# EAGLE board Servosolenoidvalve_of_Tatebayashi (EAGLE 9.4.2), part 1 of 2
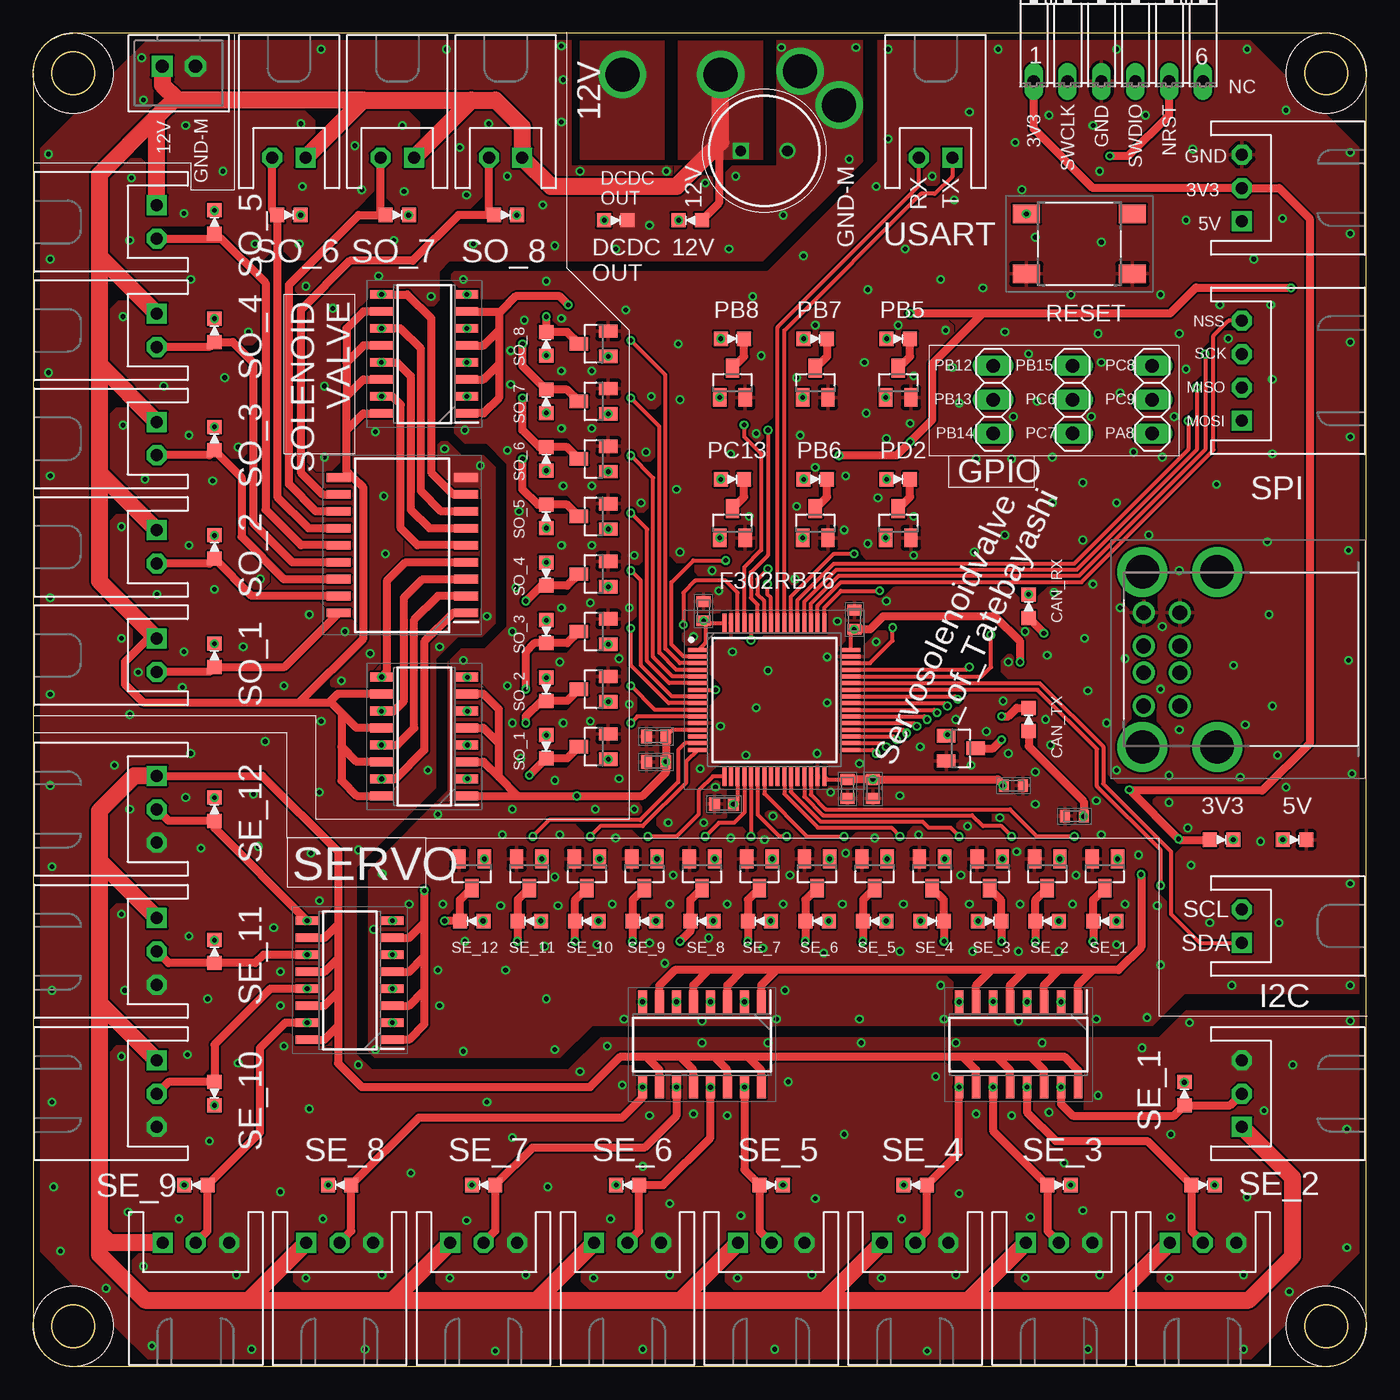
[diagram p3: board, top side]
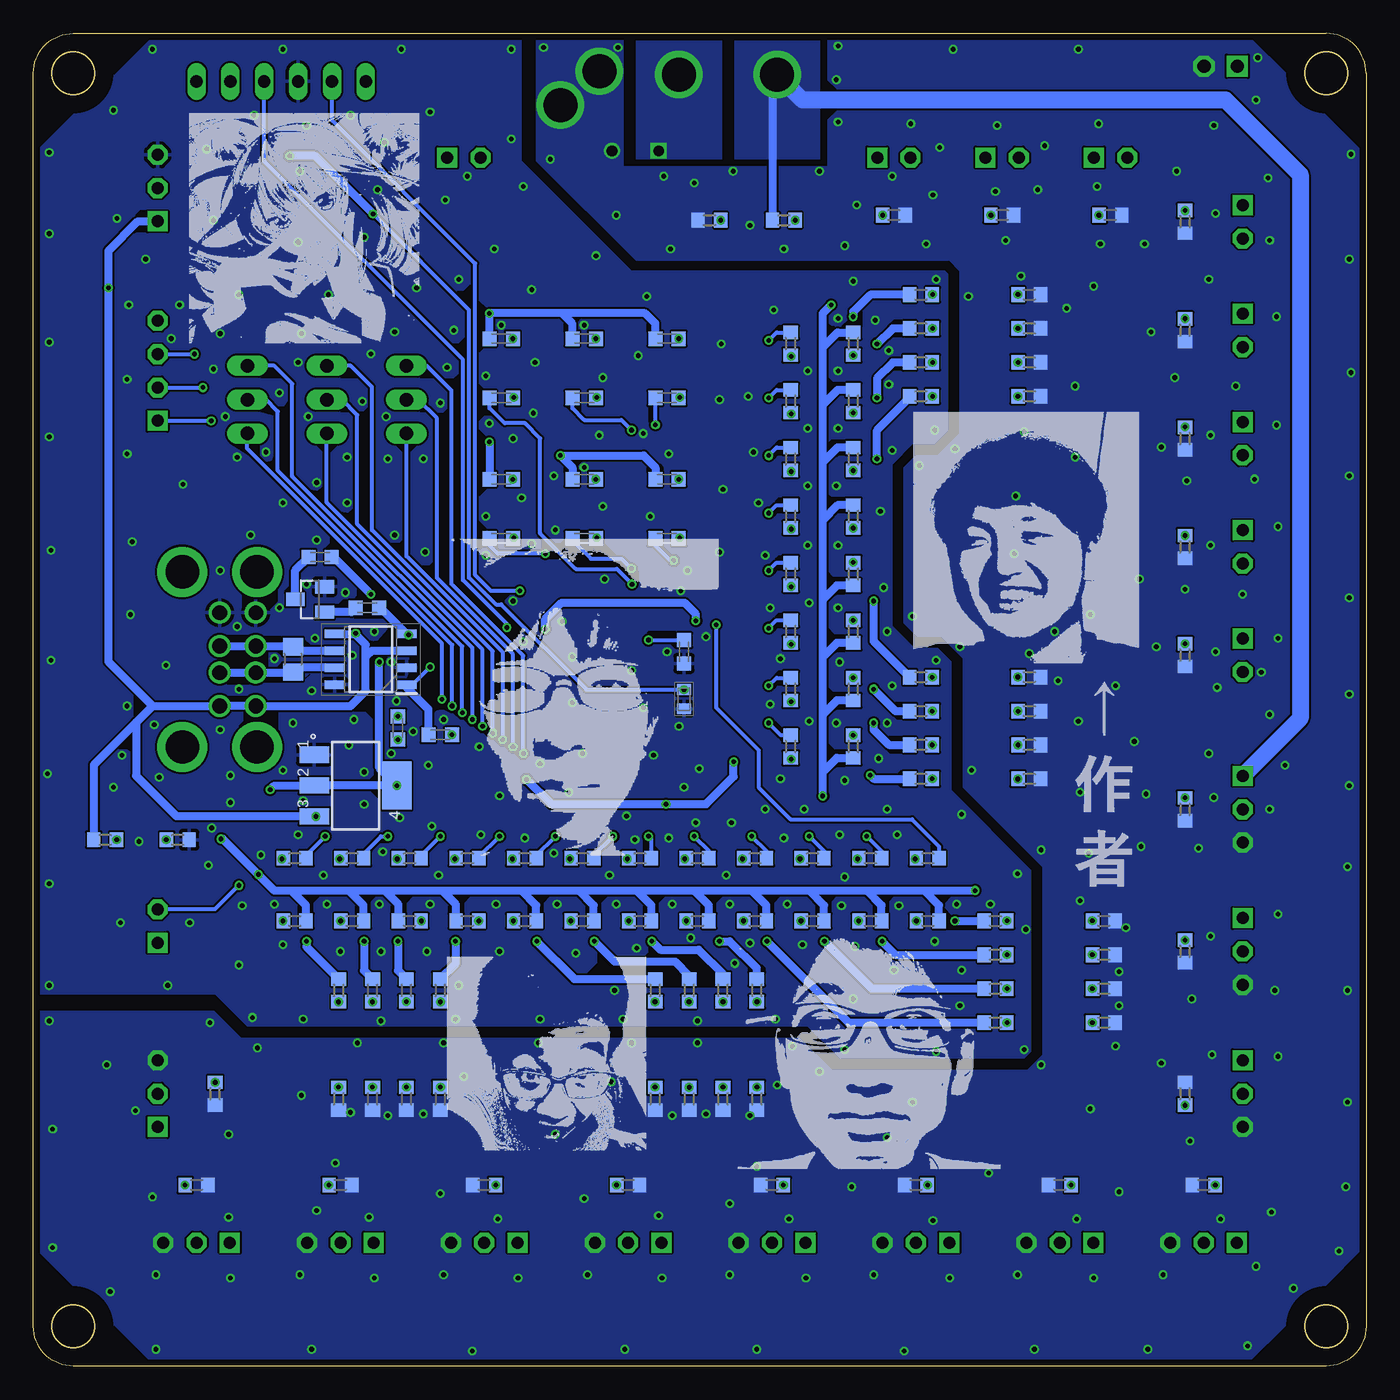
[diagram p4: board, bottom side, seen from below]

Size 100 x 100 mm. Coordinates in mm from the lower left corner, seen from the top.
Outline: 3,0 97,0 arc90 100,3 100,97 arc90 97,100 3,100 arc90 0,97 0,3 arc90 3,0
Outline: circle at 3,3 radius 1.6
Outline: circle at 3,97 radius 1.6
Outline: circle at 97,97 radius 1.6
Outline: circle at 97,3 radius 1.6
Copper layers (1*16): Top 0.035mm / dielectric 1.6mm / Bottom 0.035mm
Design rules "Elecrow_2-layer_PCB_eagle_rule": minimum track width 6mil, minimum drill 12mil, track to track 6mil, track to pad 6mil, pad to pad 6mil, via to via 8mil, smd to smd 0mil, copper to edge 20mil, drill to drill 10mil, minimum pad ring 6mil, minimum via ring 6mil, stop-mask expansion 0mil, vias tented up to drill 100mil, thermal gap 10mil
tRestrict: area 94,0 to 100,6; area 94,94 to 100,100; area 0,0 to 6,6; area 0,94 to 6,100; 335 lines
bRestrict: area 94,94 to 100,100; area 0,94 to 6,100; area 94,0 to 100,6; area 0,0 to 6,6; 283 lines

## Footprints (pad centres in the part's own frame; a part is rotated, then mirrored left to right if it is on the bottom)
CAPC1709X100N = smd 0.81 x 1.04: 1 -0.72,0; 2 0.72,0
CAPC1608X90N = smd 0.75 x 0.94: 1 -0.7,0; 2 0.7,0
CAPPRD350W60D825H1150 = drill 0.8 pad 1.2 square: 1 0,0 | drill 0.8 pad 1.2: 2 3.5,0
QFP50P1200X1200X160-64N = smd 1.475 x 0.3: 1 -5.738,3.75; 2 -5.738,3.25; 3 -5.738,2.75; 4 -5.738,2.25; 5 -5.738,1.75; 6 -5.738,1.25; 7 -5.738,0.75; 8 -5.738,0.25; 9 -5.738,-0.25; 10 -5.738,-0.75; 11 -5.738,-1.25; 12 -5.738,-1.75; 13 -5.738,-2.25; 14 -5.738,-2.75; 15 -5.738,-3.25; 16 -5.738,-3.75; 33 5.738,-3.75; 34 5.738,-3.25; 35 5.738,-2.75; 36 5.738,-2.25; 37 5.738,-1.75; 38 5.738,-1.25; 39 5.738,-0.75; 40 5.738,-0.25; 41 5.738,0.25; 42 5.738,0.75; 43 5.738,1.25; 44 5.738,1.75; 45 5.738,2.25; 46 5.738,2.75; 47 5.738,3.25; 48 5.738,3.75 | smd 0.3 x 1.475: 17 -3.75,-5.738; 18 -3.25,-5.738; 19 -2.75,-5.738; 20 -2.25,-5.738; 21 -1.75,-5.738; 22 -1.25,-5.738; 23 -0.75,-5.738; 24 -0.25,-5.738; 25 0.25,-5.738; 26 0.75,-5.738; 27 1.25,-5.738; 28 1.75,-5.738; 29 2.25,-5.738; 30 2.75,-5.738; 31 3.25,-5.738; 32 3.75,-5.738; 49 3.75,5.738; 50 3.25,5.738; 51 2.75,5.738; 52 2.25,5.738; 53 1.75,5.738; 54 1.25,5.738; 55 0.75,5.738; 56 0.25,5.738; 57 -0.25,5.738; 58 -0.75,5.738; 59 -1.25,5.738; 60 -1.75,5.738; 61 -2.25,5.738; 62 -2.75,5.738; 63 -3.25,5.738; 64 -3.75,5.738
SOIC127P600X175-8N = smd 1.5 x 0.65: 1 -2.7,1.905; 2 -2.7,0.635; 3 -2.7,-0.635; 4 -2.7,-1.905; 5 2.7,-1.905; 6 2.7,-0.635; 7 2.7,0.635; 8 2.7,1.905
SOP128P700X220-16N = smd 1.7 x 0.65: 1 -3.2,4.462; 2 -3.2,3.188; 3 -3.2,1.912; 4 -3.2,0.638; 5 -3.2,-0.638; 6 -3.2,-1.912; 7 -3.2,-3.188; 8 -3.2,-4.462; 9 3.2,-4.462; 10 3.2,-3.188; 11 3.2,-1.912; 12 3.2,-0.638; 13 3.2,0.638; 14 3.2,1.912; 15 3.2,3.188; 16 3.2,4.462
SOIC127P1030X245-18N = smd 1.8 x 0.65: 1 -4.775,5.08; 2 -4.775,3.81; 3 -4.775,2.54; 4 -4.775,1.27; 5 -4.775,0; 6 -4.775,-1.27; 7 -4.775,-2.54; 8 -4.775,-3.81; 9 -4.775,-5.08; 10 4.775,-5.08; 11 4.775,-3.81; 12 4.775,-2.54; 13 4.775,-1.27; 14 4.775,0; 15 4.775,1.27; 16 4.775,2.54; 17 4.775,3.81; 18 4.775,5.08
USB4AF203AS = drill 1.1 pad 1.65: 1 0,0; 2 2.5,0; 3 4.5,0; 4 7,0; 5 0,-2.71; 6 2.5,-2.71; 7 4.5,-2.71; 8 7,-2.71 | drill 2.5 pad 3.75: MH1 -3.07,0.09; MH2 10.07,0.09; MH3 -3.07,-5.51; MH4 10.07,-5.51
1X03 = drill 1.016 long: 1 -2.54,0; 2 0,0; 3 2.54,0
LED1608 = smd 1.05 x 1.08: A -0.875,0; K 0.875,0
SOT-23 = smd 1 x 1.4: 1 -0.95,-1.1; 2 0.95,-1.1; 3 0,1.1
1608 = smd 1.05 x 1.08: 1 -0.875,0; 2 0.875,0
R0603 = smd 1 x 1.1: 1 -0.85,0; 2 0.85,0
R0805 = smd 1.3 x 1.5: 1 -0.95,0; 2 0.95,0
SMD1608 = smd 1.05 x 1.08: 1 -0.875,0; 2 0.875,0
TSHAT25B219E = smd 2.05 x 1.4: A1 -3.975,2.25; B1 3.975,2.25; C1 -3.975,-2.25; D1 3.975,-2.25
06PA = drill 0.914 long: 1 -6.35,0; 2 -3.81,0; 3 -1.27,0; 4 1.27,0; 5 3.81,0; 6 6.35,0
SOT223 = smd 2.235 x 1.219: 1 -3.099,2.311; 2 -3.099,0; 3 -3.099,-2.311 | smd 2.2 x 3.6: 4 3.099,0
S2B-XH-A = drill 0.9 pad 1.5 square: 1 1.25,0 | drill 0.9 pad 1.5 octagon: 2 -1.25,0
S3B-XH-A = drill 0.9 pad 1.5 square: 1 2.5,0 | drill 0.9 pad 1.5 octagon: 2 0,0; 3 -2.5,0
S4B-XH-A = drill 0.9 pad 1.5 square: 1 3.75,0 | drill 0.9 pad 1.5 octagon: 2 1.25,0; 3 -1.25,0; 4 -3.75,0
B2B-XH-A = drill 1 pad 1.6 square: 1 1.25,0 | drill 1 pad 1.6 octagon: 2 -1.25,0

## Placement (x,y rotation side)
C1  100n  [CAPC1709X100N]  51.82,42.16 0 top
C2  10uF  [CAPC1608X90N]  73.53,43.56 180 top
C5  25PK470MEFC8X11.5  [CAPPRD350W60D825H1150]  53.09,91.19 0 top
C9  100n  [CAPC1709X100N]  61.59,56.01 270 top
C10  100n  [CAPC1709X100N]  50.29,56.64 270 top
C11  100n  [CAPC1709X100N]  61.09,43.31 90 top
C17  4.7u  [CAPC1709X100N]  62.99,43.31 90 top
C18  10n  [CAPC1709X100N]  46.74,47.24 0 top
C19  1u  [CAPC1709X100N]  46.74,45.34 0 top
C22  100n  [CAPC1608X90N]  78.11,41.27 0 top
C23  0.1u  [CAPC1709X100N]  51.18,50.04 90 bottom
IC1  STM32F302RBT6  [QFP50P1200X1200X160-64N]  55.59,50 0 top
IC2  NCV7351D1ER2G  [SOIC127P600X175-8N]  74.68,53.04 180 bottom
IC4  TLP293-4_GB  [SOP128P700X220-16N]  50.16,24.13 270 top
IC5  TLP293-4_GB  [SOP128P700X220-16N]  23.75,28.96 180 top
IC6  TD62083AFG,N,EL  [SOIC127P1030X245-18N]  27.69,61.59 180 top
IC7  TLP293-4_GB  [SOP128P700X220-16N]  29.34,47.24 180 top
IC8  TLP293-4_GB  [SOP128P700X220-16N]  29.34,75.95 180 top
IC9  TLP293-4_GB  [SOP128P700X220-16N]  73.91,24.13 270 top
J2  USB-4AF203AS  [USB4AF203AS]  83.31,49.53 90 top
JP1  [1X03]  83.95,72.52 90 top
JP2  [1X03]  77.98,72.52 90 top
JP3  [1X03]  72.01,72.52 90 top
LED1  LED1608  [LED1608]  13.59,53.34 90 top
LED2  LED1608  [LED1608]  94.61,39.5 0 top
LED3  LED1608  [LED1608]  89.15,39.5 0 top
LED4  LED1608  [LED1608]  13.59,61.47 90 top
LED5  LED1608  [LED1608]  13.59,69.6 90 top
LED6  LED1608  [LED1608]  86.36,20.45 90 top
LED7  LED1608  [LED1608]  67.44,33.4 0 top
LED8  LED1608  [LED1608]  87.76,13.59 0 top
LED9  LED1608  [LED1608]  13.59,77.72 90 top
LED10  LED1608  [LED1608]  13.59,85.85 90 top
LED11  LED1608  [LED1608]  19.18,86.36 0 top
LED12  LED1608  [LED1608]  27.3,86.36 0 top
LED13  LED1608  [LED1608]  35.43,86.36 0 top
LED14  LED1608  [LED1608]  64.9,66.55 0 top
LED15  LED1608  [LED1608]  64.9,77.09 0 top
LED16  LED1608  [LED1608]  58.67,66.55 0 top
LED17  LED1608  [LED1608]  58.67,77.09 0 top
LED18  LED1608  [LED1608]  76.96,13.59 0 top
LED19  LED1608  [LED1608]  66.17,13.59 180 top
LED20  LED1608  [LED1608]  55.37,13.59 0 top
LED21  LED1608  [LED1608]  38.48,68.07 90 top
LED22  LED1608  [LED1608]  38.48,72.39 90 top
LED23  LED1608  [LED1608]  38.48,76.71 90 top
LED24  LED1608  [LED1608]  38.48,46.48 270 top
LED25  LED1608  [LED1608]  38.48,50.8 270 top
LED26  LED1608  [LED1608]  38.48,55.12 270 top
LED27  LED1608  [LED1608]  38.48,59.44 270 top
LED28  LED1608  [LED1608]  44.58,13.59 180 top
LED29  LED1608  [LED1608]  52.45,77.09 0 top
LED30  LED1608  [LED1608]  33.78,13.59 180 top
LED31  LED1608  [LED1608]  22.99,13.59 180 top
LED32  LED1608  [LED1608]  41.53,33.4 180 top
LED33  LED1608  [LED1608]  63.12,33.4 180 top
LED34  LED1608  [LED1608]  37.21,33.4 180 top
LED35  LED1608  [LED1608]  80.39,33.4 180 top
LED36  LED1608  [LED1608]  54.48,33.4 180 top
LED37  LED1608  [LED1608]  76.07,33.4 180 top
LED38  LED1608  [LED1608]  50.16,33.4 180 top
LED39  LED1608  [LED1608]  38.48,63.75 90 top
LED40  LED1608  [LED1608]  52.45,66.55 0 top
LED41  LED1608  [LED1608]  49.28,85.98 180 top
LED42  LED1608  [LED1608]  58.8,33.4 180 top
LED43  LED1608  [LED1608]  32.89,33.4 180 top
LED44  LED1608  [LED1608]  71.75,33.4 0 top
LED45  LED1608  [LED1608]  45.85,33.4 180 top
LED46  LED1608  [LED1608]  12.19,13.59 180 top
LED47  LED1608  [LED1608]  13.59,20.45 270 top
LED48  LED1608  [LED1608]  13.59,31.11 90 top
LED49  LED1608  [LED1608]  13.59,41.78 90 top
LED50  LED1608  [LED1608]  43.69,85.98 0 top
LED51-G  LED1608  [LED1608]  74.68,48.51 90 top
LED52-Y  LED1608  [LED1608]  74.68,57.02 90 top
Q9  SOT-23_NMOS  [SOT-23]  69.6,46.35 270 top
Q10  SOT-23_NMOS  [SOT-23]  79.25,57.53 90 bottom
R1  10k  [1608]  51.18,53.59 270 bottom
R2  1k  [R0603]  94.61,39.5 0 bottom
R3  1k  [R0603]  89.15,39.5 0 bottom
R4  300  [R0603]  33.4,44.07 180 bottom
R5  120  [R0805]  80.52,53.04 270 bottom
R6  300  [R0603]  33.4,46.61 180 bottom
R7  300  [R0603]  33.4,49.15 180 bottom
R8  300  [R0603]  33.4,51.69 180 bottom
R9  10k  [SMD1608]  52.45,72.64 0 bottom
R10  1k  [SMD1608]  52.45,77.09 0 bottom
R11  10k  [SMD1608]  52.45,62.1 0 bottom
R12  1k  [R0603]  25.27,44.07 180 bottom
R13  1k  [R0603]  25.27,46.61 180 bottom
R14  1k  [R0603]  25.27,49.15 180 bottom
R15  1k  [R0603]  25.27,51.69 180 bottom
R16  1k  [R0603]  25.27,72.77 180 bottom
R17  1k  [R0603]  25.27,75.31 180 bottom
R18  1k  [R0603]  25.27,77.85 180 bottom
R19  1k  [R0603]  25.27,80.39 180 bottom
R20  1k  [SMD1608]  52.45,66.55 0 bottom
R21  300  [R0603]  33.4,72.77 180 bottom
R22  300  [R0603]  33.4,75.31 180 bottom
R23  300  [R0603]  33.4,77.85 180 bottom
R24  300  [R0603]  33.4,80.39 180 bottom
R25  10k  [R0603]  49.28,85.98 180 bottom
R26  300  [R0603]  27.81,25.78 180 bottom
R27  300  [R0603]  27.81,28.32 180 bottom
R28  300  [R0603]  27.81,30.86 180 bottom
R29  300  [R0603]  77.09,28.19 90 bottom
R30  300  [R0603]  74.55,28.19 90 bottom
R31  300  [R0603]  72.01,28.19 90 bottom
R32  300  [R0603]  69.47,28.19 90 bottom
R33  1k  [R0603]  77.09,20.07 90 bottom
R34  1k  [R0603]  74.55,20.07 90 bottom
R35  1k  [R0603]  72.01,20.07 90 bottom
R36  1k  [R0603]  69.47,20.07 90 bottom
R37  300  [R0603]  53.34,28.19 90 bottom
R38  300  [R0603]  50.8,28.19 90 bottom
R39  300  [R0603]  48.26,28.19 90 bottom
R40  300  [R0603]  45.72,28.19 90 bottom
R41  1k  [R0603]  53.34,20.07 90 bottom
R42  1k  [R0603]  50.8,20.07 90 bottom
R43  1k  [R0603]  48.26,20.07 90 bottom
R44  1k  [R0603]  45.72,20.07 90 bottom
R45  1k  [R0603]  38.48,46.48 90 bottom
R46  10k  [R0603]  13.59,53.34 270 bottom
R47  10k  [R0603]  13.59,61.47 270 bottom
R48  10k  [R0603]  13.59,69.6 270 bottom
R49  10k  [R0603]  13.59,77.72 270 bottom
R50  10k  [R0603]  13.59,85.85 270 bottom
R51  10k  [R0603]  19.18,86.36 0 bottom
R52  10k  [R0603]  27.3,86.36 0 bottom
R53  10k  [R0603]  35.43,86.36 0 bottom
R54  1k  [R0603]  43.18,46.48 270 bottom
R55  1k  [R0603]  38.48,50.8 90 bottom
R56  1k  [R0603]  43.18,50.8 270 bottom
R57  1k  [R0603]  38.48,55.12 90 bottom
R58  1k  [R0603]  43.18,55.12 270 bottom
R59  10k  [SMD1608]  64.9,62.1 0 bottom
R60  1k  [SMD1608]  64.9,66.55 0 bottom
R61  10k  [SMD1608]  64.9,72.64 0 bottom
R62  1k  [SMD1608]  64.9,77.09 0 bottom
R63  10k  [SMD1608]  58.67,62.1 0 bottom
R64  1k  [SMD1608]  58.67,66.55 0 bottom
R65  10k  [SMD1608]  58.67,72.64 0 bottom
R66  1k  [SMD1608]  58.67,77.09 0 bottom
R67  1k  [R0603]  38.48,59.44 90 bottom
R68  1k  [R0603]  43.18,59.44 270 bottom
R69  1k  [R0603]  38.48,63.75 270 bottom
R70  1k  [R0603]  43.18,63.75 270 bottom
R71  1k  [R0603]  38.48,68.07 270 bottom
R72  1k  [R0603]  43.18,68.07 270 bottom
R73  1k  [R0603]  38.48,72.39 270 bottom
R74  1k  [R0603]  43.18,72.39 270 bottom
R75  1k  [R0603]  38.48,76.71 270 bottom
R76  1k  [R0603]  43.18,76.71 270 bottom
R77  1k  [R0603]  80.39,33.4 180 bottom
R78  1k  [R0603]  86.36,20.45 270 bottom
R79  1k  [R0603]  87.76,13.59 0 bottom
R80  1k  [R0603]  76.96,13.59 0 bottom
R81  1k  [R0603]  66.17,13.59 180 bottom
R82  1k  [R0603]  55.37,13.59 0 bottom
R83  1k  [R0603]  44.58,13.59 180 bottom
R84  1k  [R0603]  33.78,13.59 180 bottom
R85  1k  [R0603]  22.99,13.59 180 bottom
R86  1k  [R0603]  80.39,38.1 180 bottom
R87  1k  [R0603]  54.48,33.4 180 bottom
R88  1k  [R0603]  54.48,38.1 180 bottom
R89  1k  [R0603]  76.07,33.4 180 bottom
R90  1k  [R0603]  76.07,38.1 180 bottom
R91  1k  [R0603]  50.16,33.4 180 bottom
R92  1k  [R0603]  50.16,38.1 180 bottom
R93  1k  [R0603]  67.44,33.4 0 bottom
R94  1k  [R0603]  67.44,38.1 180 bottom
R95  1k  [R0603]  41.53,33.4 180 bottom
R96  1k  [R0603]  41.53,38.1 180 bottom
R97  1k  [R0603]  63.12,33.4 180 bottom
R98  1k  [R0603]  63.12,38.1 180 bottom
R99  1k  [R0603]  37.21,33.4 180 bottom
R100  1k  [R0603]  37.21,38.1 180 bottom
R101  300  [R0603]  27.81,33.4 180 bottom
R102  1k  [R0603]  19.68,25.78 180 bottom
R103  1k  [R0603]  19.68,28.32 180 bottom
R104  1k  [R0603]  19.68,30.86 180 bottom
R105  1k  [R0603]  19.68,33.4 180 bottom
R106  1k  [R0603]  71.75,33.4 0 bottom
R107  1k  [R0603]  71.75,38.1 180 bottom
R108  1k  [R0603]  45.85,33.4 180 bottom
R109  1k  [R0603]  45.85,38.1 180 bottom
R110  1k  [R0603]  58.8,33.4 180 bottom
R111  1k  [R0603]  58.8,38.1 180 bottom
R112  1k  [R0603]  32.89,33.4 180 bottom
R113  1k  [R0603]  32.89,38.1 180 bottom
R114  1k  [R0603]  12.19,13.59 180 bottom
R115  1k  [R0603]  13.59,20.45 90 bottom
R116  1k  [R0603]  13.59,31.11 270 bottom
R117  1k  [R0603]  13.59,41.78 270 bottom
R118  1k  [R0603]  43.69,85.98 0 bottom
R119  1k  [SMD1608]  72.64,47.88 270 bottom
R120  1k  [SMD1608]  78.49,60.71 180 bottom
R121  10k  [SMD1608]  69.47,47.37 180 bottom
R122  10k  [SMD1608]  74.93,56.9 0 bottom
S2  TSHA-T-2.5B2-19E  [TSHAT25B219E]  78.49,84.2 0 top
SL1  [06PA]  81.41,96.39 0 top
TR1  2SC2712GR  [SOT-23]  42.04,59.44 90 top
TR2  2SC2712GR  [SOT-23]  80.39,36.96 180 top
TR3  2SC2712GR  [SOT-23]  54.48,36.96 180 top
TR4  2SC2712GR  [SOT-23]  76.07,36.96 180 top
TR5  2SC2712GR  [SOT-23]  42.04,63.75 90 top
TR6  2SC2712GR  [SOT-23]  42.04,68.07 90 top
TR7  2SC2712GR  [SOT-23]  42.04,72.39 90 top
TR8  2SC2712GR  [SOT-23]  42.04,76.71 90 top
TR9  2SC2712GR  [SOT-23]  42.04,46.48 90 top
TR10  2SC2712GR  [SOT-23]  42.04,50.8 90 top
TR11  2SC2712GR  [SOT-23]  42.04,55.12 90 top
TR12  2SC2712GR  [SOT-23]  64.9,63.25 0 top
TR13  2SC2712GR  [SOT-23]  64.9,73.79 0 top
TR14  2SC2712GR  [SOT-23]  58.67,63.25 0 top
TR15  2SC2712GR  [SOT-23]  50.16,36.96 180 top
TR16  2SC2712GR  [SOT-23]  67.44,36.96 180 top
TR17  2SC2712GR  [SOT-23]  58.67,73.79 0 top
TR18  2SC2712GR  [SOT-23]  41.53,36.96 180 top
TR19  2SC2712GR  [SOT-23]  63.12,36.96 180 top
TR20  2SC2712GR  [SOT-23]  37.21,36.96 180 top
TR21  2SC2712GR  [SOT-23]  52.45,73.79 0 top
TR22  2SC2712GR  [SOT-23]  52.45,63.25 0 top
TR23  2SC2712GR  [SOT-23]  71.75,36.96 180 top
TR24  2SC2712GR  [SOT-23]  45.85,36.96 180 top
TR25  2SC2712GR  [SOT-23]  58.8,36.96 180 top
TR26  2SC2712GR  [SOT-23]  32.89,36.96 180 top
U1  LD1117S33CTR  [SOT223]  75.82,43.56 0 bottom
X1  S2B-XH-A  [S2B-XH-A]  9.27,77.72 90 top
X2  S3B-XH-A  [S3B-XH-A]  22.99,9.27 180 top
X3  S3B-XH-A  [S3B-XH-A]  33.78,9.27 180 top
X4  S3B-XH-A  [S3B-XH-A]  9.27,41.78 90 top
X5  S2B-XH-A  [S2B-XH-A]  9.27,53.34 90 top
X6  S2B-XH-A  [S2B-XH-A]  9.27,61.47 90 top
X7  S2B-XH-A  [S2B-XH-A]  9.27,69.6 90 top
X8  S4B-XH-A  [S4B-XH-A]  90.68,74.68 270 top
X9  S2B-XH-A  [S2B-XH-A]  9.27,85.85 90 top
X10  S2B-XH-A  [S2B-XH-A]  19.18,90.68 0 top
X11  S2B-XH-A  [S2B-XH-A]  27.3,90.68 0 top
X12  S2B-XH-A  [S2B-XH-A]  35.43,90.68 0 top
X13  S3B-XH-A  [S3B-XH-A]  9.27,31.11 90 top
X14  S3B-XH-A  [S3B-XH-A]  9.27,20.45 90 top
X15  S3B-XH-A  [S3B-XH-A]  12.19,9.27 180 top
X16  S3B-XH-A  [S3B-XH-A]  44.58,9.27 180 top
X17  S3B-XH-A  [S3B-XH-A]  55.37,9.27 180 top
X18  S2B-XH-A  [S2B-XH-A]  67.69,90.68 0 top
X19  S2B-XH-A  [S2B-XH-A]  90.68,33.02 270 top
X20  S3B-XH-A  [S3B-XH-A]  66.17,9.27 180 top
X21  S3B-XH-A  [S3B-XH-A]  76.96,9.27 180 top
X22  S3B-XH-A  [S3B-XH-A]  90.68,88.39 270 top
X23  S3B-XH-A  [S3B-XH-A]  87.76,9.27 180 top
X24  S3B-XH-A  [S3B-XH-A]  90.68,20.45 270 top
X25  B2B-XH-A  [B2B-XH-A]  10.92,97.54 180 top